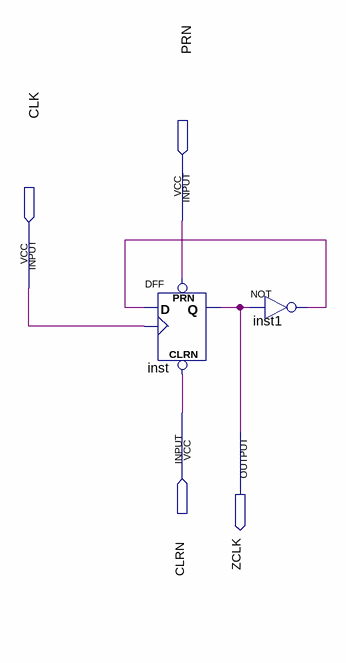
[diagram p0: schematic sheet]
// Quartus schematic Test_CLK_DIV.bdf as structural Verilog: 2 symbols, 4 pins
module Test_CLK_DIV (
  input  PRN,
  input  CLK,
  input  CLRN,
  output ZCLK
);

  wire inst1_out;

  DFF inst (.CLRN(CLRN), .CLK(CLK), .D(inst1_out), .PRN(PRN), .Q(ZCLK));
  not inst1 (inst1_out, ZCLK);
endmodule
